# Altium schematic sheet OMT_Cpu51.SchDoc
size A; Organization: Altium Limited; Address1: L3, 12a Rodborough Rd; Address2: Frenchs Forest; Address3: NSW; Address4: Australia 2086; DocumentNumber: 2; SheetNumber: 2; SheetTotal: 5
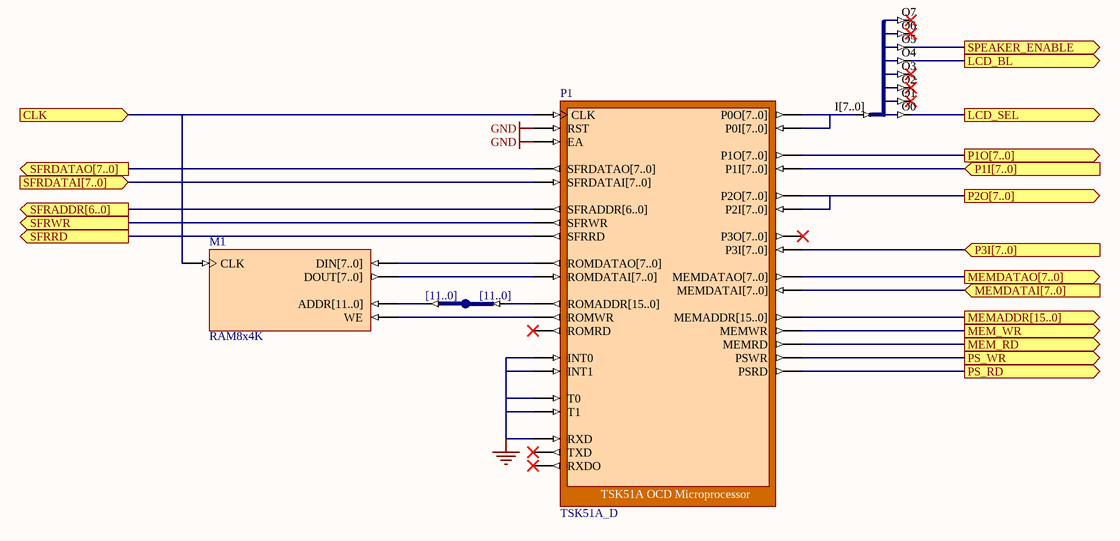
[diagram p0: OMT_Cpu51.SchDoc]

## Parts
JB_S2  IndexA: [11..0]  (hidden comment: JB)
M1  RAM8x4K
P1  TSK51A_D
U17  J8B_8S  (value not drawn)

## Ports
CLK (in), LCD_BL (out), LCD_SEL (out), MEM_RD (out), MEM_WR (out), MEMADDR[15..0] (out), MEMDATAI[7..0] (in), MEMDATAO[7..0] (out), P1I[7..0] (in), P1O[7..0] (out), P2O[7..0] (out), P3I[7..0] (in), PS_RD (out), PS_WR (out), SFRADDR[6..0] (out), SFRDATAI[7..0] (in), SFRDATAO[7..0] (out), SFRRD (out), SFRWR (out), SPEAKER_ENABLE (out)

## Nets
GND: P1.EA P1.INT0 P1.INT1 P1.RST P1.RXD P1.T0 P1.T1
CLK: M1.CLK P1.CLK ; port CLK
LCD_BL: U17.O4 ; port LCD_BL
LCD_SEL: U17.O0 ; port LCD_SEL
MEM_RD: P1.MEMRD ; port MEM_RD
MEM_WR: P1.MEMWR ; port MEM_WR
MEMADDR[15..0]: P1.MEMADDR[15..0] ; port MEMADDR[15..0]
MEMDATAI[7..0]: P1.MEMDATAI[7..0] ; port MEMDATAI[7..0]
MEMDATAO[7..0]: P1.MEMDATAO[7..0] ; port MEMDATAO[7..0]
P1I[7..0]: P1.P1I[7..0] ; port P1I[7..0]
P1O[7..0]: P1.P1O[7..0] ; port P1O[7..0]
P2O[7..0]: P1.P2I[7..0] P1.P2O[7..0] ; port P2O[7..0]
P3I[7..0]: P1.P3I[7..0] ; port P3I[7..0]
PS_RD: P1.PSRD ; port PS_RD
PS_WR: P1.PSWR ; port PS_WR
SFRADDR[6..0]: P1.SFRADDR[6..0] ; port SFRADDR[6..0]
SFRDATAI[7..0]: P1.SFRDATAI[7..0] ; port SFRDATAI[7..0]
SFRDATAO[7..0]: P1.SFRDATAO[7..0] ; port SFRDATAO[7..0]
SFRRD: P1.SFRRD ; port SFRRD
SFRWR: P1.SFRWR ; port SFRWR
SPEAKER_ENABLE: U17.O5 ; port SPEAKER_ENABLE
NetJB_S2_A[0..0]: JB_S2.A[0..0](IA[0..0]) M1.ADDR[11..0]
NetJB_S2_B[0..0]: JB_S2.B[0..0] P1.ROMADDR[15..0]
NetM1_DIN[7..0]: M1.DIN[7..0] P1.ROMDATAO[7..0]
NetM1_DOUT[7..0]: M1.DOUT[7..0] P1.ROMDATAI[7..0]
NetM1_WE: M1.WE P1.ROMWR
NetP1_P0I[7..0]: P1.P0I[7..0] P1.P0O[7..0] U17.I[7..0]

Not connected (* = marked no-connect by the designer): P1 P3O[7..0]* ROMRD* RXDO* TXD*; U17 O1* O2* O3* O6* O7*

## Notes on the sheet
- Title
- Size:
- Date:
- A
- Number:
- Time:
- Revision:
- Sheet
- of
- File:

## Library data of the parts
JB_S2 = JB: System Joiner; Class I: Bus Joiner; ArchiveName: GENERIC; Published: 18-Sep-2003; Publisher: Altium Limited; IndexB: [11..0]
M1 = RAM8x4K: Single Port Random Access Memory 4096 x 8; Memory_Depth: 4096; Memory_Type: RAM_SinglePortBlock; Memory_Width: 8; Memory_ClockEdge: Rising; Nexus_Core: Memory_Program; Published: 26/09/2003; Publisher: Altium Hobart Technology Center
P1 = TSK51A_D: TSK51A OCD Microprocessor; NEXUS_CORE: Processor_OCDS; NEXUS_JTAG_DEVICE: True; NEXUS_JTAG_ORDER: 0; ChildModel1: RAM256x8_TSK51D; ChildCore1: M1; Published: 10/11/2003; Publisher: Altium Hobart Technology Centre; Core Revision: 1.00.00
U17 = J8B_8S: 8-Bit input bus to 8 single pin outputs; FunctionalClass: Bus Joiner; PortSize: 8; ArchiveName: GENERIC; VHDLIB_SIM: GENERIC_LIB; Published: 29-Jan-2004; Publisher: Altium Limited; LastRevisionNo: 1.00.00; HelpURL: CR0118 FPGA Generic Library Guide.pdf#page=303; ComponentLink1URL: CR0126 FPGA Bus Joiner Resource Usage.pdf#page=27; ComponentLink1Description: Core &Resource Usage